# Altium schematic sheet P-MT3620RDB-PS-1-0.SchDoc: MT3620 Prototyping Shield
size A3; DrawnBy: Nick Trim; Revision: 1.0; SheetNumber: 1; SheetTotal: 1
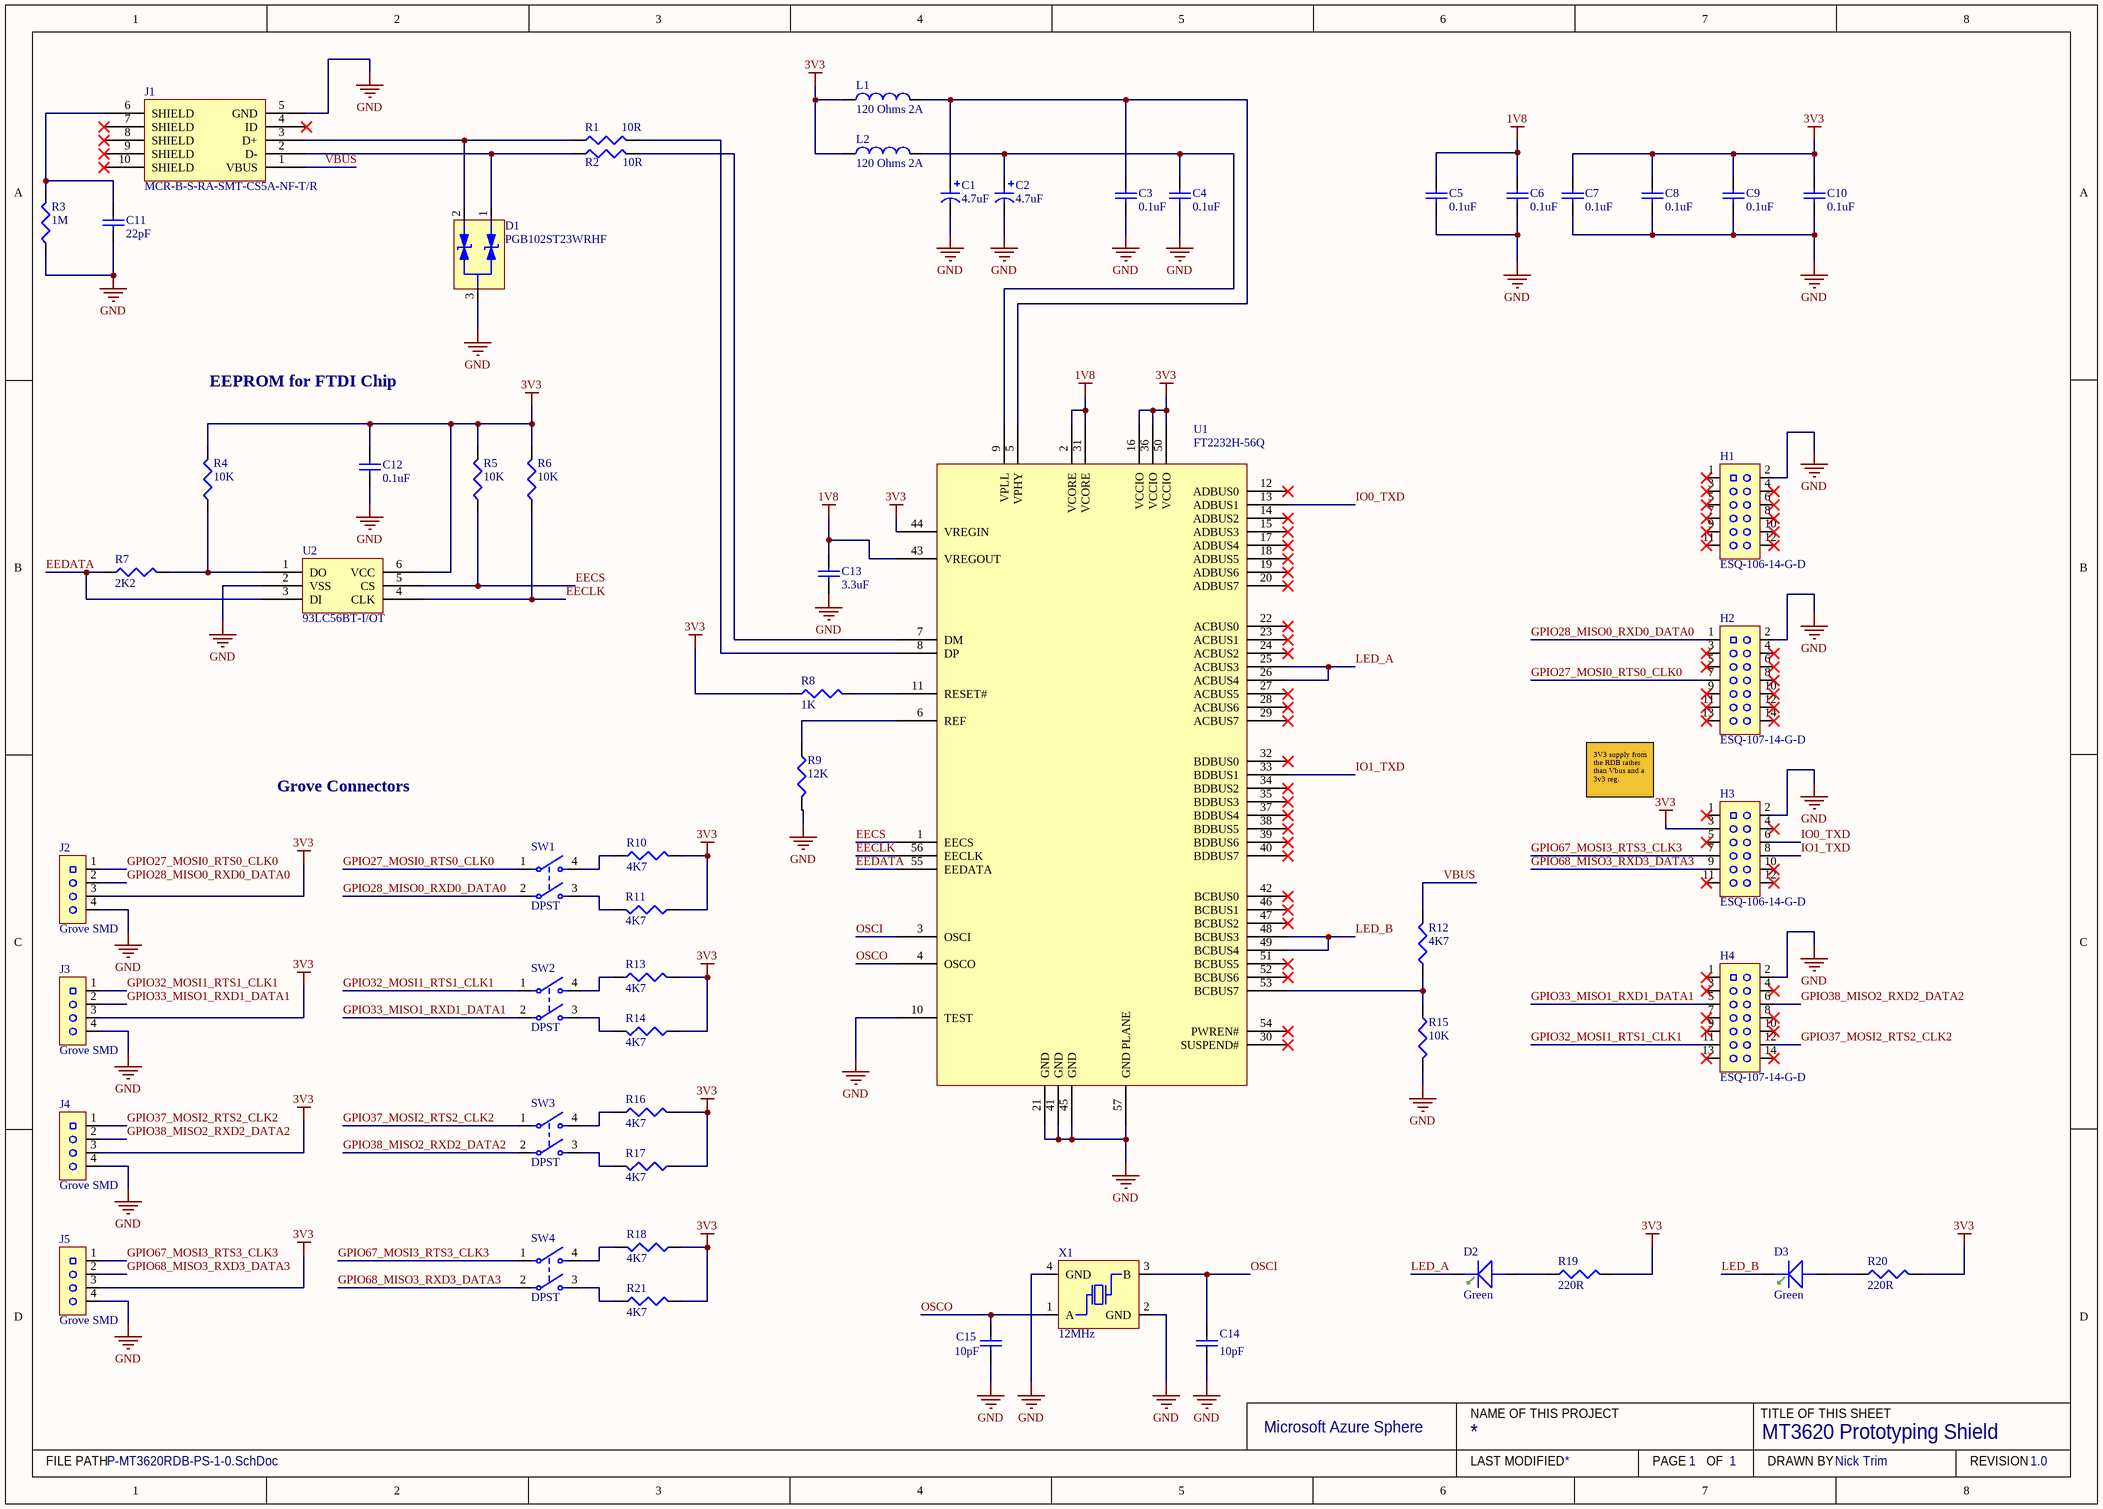
[diagram p0: P-MT3620RDB-PS-1-0.SchDoc]

## Parts
C1  4.7uF  [C0603_TANT]
C2  4.7uF  [C0603_TANT]
C3  0.1uF  [C0603]
C4  0.1uF  [C0603]
C5  0.1uF  [C0603]
C6  0.1uF  [C0603]
C7  0.1uF  [C0603]
C8  0.1uF  [C0603]
C9  0.1uF  [C0603]
C10  0.1uF  [C0603]
C11  22pF  [C0603]
C12  0.1uF  [C0603]
C13  3.3uF  [C0603]
C14  10pF  [C0603]
C15  10pF  [C0603]
D1  PGB102ST23WRHF  [SOT95P245X110-3N]
D2  Green  [Rohm SML-D12 Green]
D3  Green  [Rohm SML-D12 Green]
H1  ESQ-106-14-G-D  [ESQ-106]
H2  ESQ-107-14-G-D  [ESQ-107]
H3  ESQ-106-14-G-D  [ESQ-106]
H4  ESQ-107-14-G-D  [ESQ-107]
J1  MCR-B-S-RA-SMT-CS5A-NF-T/R  [MCR-B-S-RA-SMT-CS5-T/R]
J2  Grove SMD  [Grove way SMD]
J3  Grove SMD  [Grove way SMD]
J4  Grove SMD  [Grove way SMD]
J5  Grove SMD  [Grove way SMD]
L1  120 Ohms 2A  [0603 IND]
L2  120 Ohms 2A  [0603 IND]
R1  10R  [R0603]
R2  10R  [R0603]
R3  1M  [R0603]
R4  10K  [R0603]
R5  10K  [R0603]
R6  10K  [R0603]
R7  2K2  [R0603]
R8  1K  [R0603]
R9  12K  [R0603]
R10  4K7  [R0603]
R11  4K7  [R0603]
R12  4K7  [R0603]
R13  4K7  [R0603]
R14  4K7  [R0603]
R15  10K  [R0603]
R16  4K7  [R0603]
R17  4K7  [R0603]
R18  4K7  [R0603]
R19  220R  [R0603]
R20  220R  [R0603]
R21  4K7  [R0603]
SW1  DPST  [204-211ST]
SW2  DPST  [204-211ST]
SW3  DPST  [204-211ST]
SW4  DPST  [204-211ST]
U1  FT2232H-56Q  [FT2232H-56Q]
U2  93LC56BT-I/OT  [SOT23-93C56B]
X1  12MHz  [TXC8Z]

## Nets
1V8: C5.2 C6.2 C13.2 U1.2(VCORE) U1.31(VCORE) U1.43(VREGOUT)
3V3: C7.1 C8.2 C9.2 C10.2 C12.2 H3.3 J2.3 J3.3 J4.3 J5.3 L1.1 L2.1 R4.2 R5.2 R6.2 R8.1 R10.2 R11.1 R13.2 R14.1 R16.2 R17.1 R18.1 R19.2 R20.2 R21.2 U1.16(VCCIO) U1.36(VCCIO) U1.44(VREGIN) U1.50(VCCIO) U2.6(VCC)
GND: C1.2 C2.2 C3.2 C4.1 C5.1 C6.1 C7.2 C8.1 C9.1 C10.1 C11.1 C12.1 C13.1 C14.2 C15.2 D1.3 H1.2 H2.2 H3.2 H4.2 J1.5(GND) J2.4 J3.4 J4.4 J5.4 R3.1 R9.2 R15.2 U1.10(TEST) U1.21(GND) U1.41(GND) U1.45(GND) U1.57(GND_PLANE) U2.2(VSS) X1.2(GND) X1.4(GND)
EECLK: R6.1 U1.56(EECLK) U2.4(CLK)
EECS: R5.1 U1.1(EECS) U2.5(CS)
EEDATA: R7.1 U1.55(EEDATA) U2.3(DI)
GPIO27_MOSI0_RTS0_CLK0: H2.7 J2.1 SW1.1
GPIO28_MISO0_RXD0_DATA0: H2.1 J2.2 SW1.2
GPIO32_MOSI1_RTS1_CLK1: H4.11 J3.1 SW2.1
GPIO33_MISO1_RXD1_DATA1: H4.5 J3.2 SW2.2
GPIO37_MOSI2_RTS2_CLK2: H4.12 J4.1 SW3.1
GPIO38_MISO2_RXD2_DATA2: H4.6 J4.2 SW3.2
GPIO67_MOSI3_RTS3_CLK3: H3.7 J5.1 SW4.1
GPIO68_MISO3_RXD3_DATA3: H3.9 J5.2 SW4.2
IO0_TXD: H3.6 U1.13(ADBUS1)
IO1_TXD: H3.8 U1.33(BDBUS1)
LED_A: D2.1 U1.25(ACBUS3) U1.26(ACBUS4)
LED_B: D3.1 U1.48(BCBUS3) U1.49(BCBUS4)
OSCI: C14.1 U1.3(OSCI) X1.3(B)
OSCO: C15.1 U1.4(OSCO) X1.1(A)
VBUS: J1.1(VBUS) R12.2
NetC1_1: C1.1 C3.1 L1.2 U1.5(VPHY)
NetC2_1: C2.1 C4.2 L2.2 U1.9(VPLL)
NetC11_2: C11.2 J1.6(SHIELD) R3.2
NetD1_1: D1.1 J1.2(D-) R2.1
NetD1_2: D1.2 J1.3(D+) R1.1
NetD2_2: D2.2 R19.1
NetD3_2: D3.2 R20.1
NetR1_2: R1.2 U1.8(DP)
NetR2_2: R2.2 U1.7(DM)
NetR4_1: R4.1 R7.2 U2.1(DO)
NetR8_2: R8.2 U1.11(RESET#)
NetR9_1: R9.1 U1.6(REF)
NetR10_1: R10.1 SW1.4
NetR11_2: R11.2 SW1.3
NetR12_1: R12.1 R15.1 U1.53(BCBUS7)
NetR13_1: R13.1 SW2.4
NetR14_2: R14.2 SW2.3
NetR16_1: R16.1 SW3.4
NetR17_2: R17.2 SW3.3
NetR18_2: R18.2 SW4.4
NetR21_1: R21.1 SW4.3

Not connected (* = marked no-connect by the designer): H1 1* 3* 4* 5* 6* 7* 8* 9* 10* 11* 12*; H2 3* 4* 5* 6* 8* 9* 10* 11* 12* 13* 14*; H3 1* 4* 5* 10* 11* 12*; H4 1* 3* 4* 7* 8* 9* 10* 13* 14*; J1 4(ID)* 7(SHIELD)* 8(SHIELD)* 9(SHIELD)* 10(SHIELD)*; U1 12(ADBUS0)* 14(ADBUS2)* 15(ADBUS3)* 17(ADBUS4)* 18(ADBUS5)* 19(ADBUS6)* 20(ADBUS7)* 22(ACBUS0)* 23(ACBUS1)* 24(ACBUS2)* 27(ACBUS5)* 28(ACBUS6)* 29(ACBUS7)* 30(SUSPEND#)* 32(BDBUS0)* 34(BDBUS2)* 35(BDBUS3)* 37(BDBUS4)* 38(BDBUS5)* 39(BDBUS6)* 40(BDBUS7)* 42(BCBUS0)* 46(BCBUS1)* 47(BCBUS2)* 51(BCBUS5)* 52(BCBUS6)* 54(PWREN#)*

## Notes on the sheet
- EEPROM for FTDI Chip
- Grove Connectors
- 3V3 supply from the RDB rather than Vbus and a 3v3 reg.
- Microsoft Azure Sphere
- NAME OF THIS PROJECT
- TITLE OF THIS SHEET
- FILE PATH
- LAST MODIFIED
- PAGE
- OF
- DRAWN BY
- REVISION

## Library data of the parts
C1 C2 = F981A475MMA: AVX - F981A475MMA - Surface Mount Tantalum Capacitor, 4.7 µF, 10 V, 0603 [1608 Metric], F98 Series, ± 20%, -55 °C; Manufacturer: Kyocera AVX; Voltage Rating: 10V; ESR (Equivalent Series Resistance): 6R; Supplier 1: Digi-Key; Manufacturer Part Number: F981A475MMA; RoHS: Yes; Category: Tantalum Capacitors; Stock 1: 17846; Pricing 1: 1=0.59000, 10=0.41800, 50=0.31640, 100=0.27560, 500=0.20412, 1000=0.17350 (USD); Mount: Surface Mount; Case/Package: 0603; Case Code (Imperial): 0603; Case Code (Metric): 1608; Min Operating Temperature: -55°C; Max Operating Temperature: 125°C; Features: General Purpose; Packaging: Tape and Reel; Capacitance: 4.7uF; Tolerance: 20%; ComponentLink1URL: http://www.farnell.com/datasheets/2602422.pdf?src-supplier=Farnell; ComponentLink1Description: http://www.farnell.com/datasheets/2602422.pdf?src-supplier=Farnell; ComponentLink2URL: http://www.mouser.com/ds/2/40/f98-775787.pdf?src-supplier=Mouser; ComponentLink2Description: http://www.mouser.com/ds/2/40/f98-775787.pdf?src-supplier=Mouser; ComponentLink3URL: http://datasheets.avx.com/F98.pdf?src-supplier=Digi-Key; ComponentLink3Description: http://datasheets.avx.com/F98.pdf?src-supplier=Digi-Key; ComponentLink4URL: http://www.farnell.com/datasheets/2602422.pdf?src-supplier=Newark; ComponentLink4Description: http://www.farnell.com/datasheets/2602422.pdf?src-supplier=Newark; Supplier Part Number 1: 478-8651-1-ND
C3-C10 C12 = CL10B104KB8NNNL: CL10 Series 0603 0.1 uF 50 V ±10% Tolerance X7R Multilayer Ceramic Capacitor; Manufacturer: Samsung; Capacitance: 100nF; Voltage Rating: 50V; Supplier 1: Digi-Key; Manufacturer Part Number: CL10B104KB8NNNL; RoHS: Yes; Category: Ceramic Capacitors; Stock 1: 148896; Pricing 1: 1=0.10000, 10=0.02900, 50=0.01580, 100=0.01280, 500=0.00916, 1000=0.00720, 2500=0.00654, 5000=0.00602 (USD); Mount: Surface Mount; Case/Package: 0603; Min Operating Temperature: -55°C; Max Operating Temperature: 125°C; Tolerance: 10%; Packaging: Tape and Reel; Package Quantity: 15000; Dielectric: X7R; Voltage Rating (DC): 50V; Length: 1.6mm; Width: 0.031inch; Height: 0.8mm; Thickness: 0.035inch; Depth: 0.8mm; Radiation Hardening: No; ComponentLink1URL: https://datasheet.ciiva.com/26838/getdatasheetpartid-357523-26838415.pdf?src-supplier=Verical; ComponentLink1Description: https://datasheet.ciiva.com/26838/getdatasheetpartid-357523-26838415.pdf?src-supplier=Verical; ComponentLink2URL: https://datasheet.ciiva.com/25741/cl10b104kb8nnnl-25741341.pdf?src-supplier=Digi-Key; ComponentLink2Description: https://datasheet.ciiva.com/25741/cl10b104kb8nnnl-25741341.pdf?src-supplier=Digi-Key; Supplier Part Number 1: 1276-CL10B104KB8NNNLCT-ND
C11 = CC0603JRNPO9BN220: Cap Ceramic 22pF 50VDC C0G 5% SMD 0603 Paper T/R; Manufacturer: Yageo; Voltage Rating: 50V; Temperature Coefficient: 30ppm/°C; Insulation Resistance: 10GR; Supplier 1: Digi-Key; Manufacturer Part Number: CC0603JRNPO9BN220; RoHS: Yes; Category: Ceramic Capacitors; Stock 1: 139430; Pricing 1: 1=0.10000, 10=0.04200, 50=0.02320, 100=0.01890, 500=0.01348, 1000=0.01059 (USD); Mount: Surface Mount; Case/Package: 0603; Number of Pins: 2; Case Code (Imperial): 0603; Case Code (Metric): 1608; Min Operating Temperature: -55°C; Max Operating Temperature: 125°C; Capacitance: 22pF; Tolerance: 5%; Voltage Rating (DC): 50V; Packaging: Tape and Reel; Package Quantity: 1; Dielectric: C0G; Termination: SMD/SMT; Voltage: 50V; Length: 1.6mm; Width: 0.031inch; Height: 0.8mm; Thickness: 0.035inch; Depth: 0.8mm; Radiation Hardening: No; REACH SVHC: No SVHC; Lead Free: Lead Free; ComponentLink1URL: https://datasheet.ciiva.com/11786/0900766b8079c870-11786216.pdf?src-supplier=RSComponents; ComponentLink1Description: https://datasheet.ciiva.com/11786/0900766b8079c870-11786216.pdf?src-supplier=RSComponents; ComponentLink2URL: https://datasheet.ciiva.com/8033/1734582-8033749.pdf?src-supplier=Element14; ComponentLink2Description: https://datasheet.ciiva.com/8033/1734582-8033749.pdf?src-supplier=Element14; ComponentLink3URL: https://datasheet.ciiva.com/144/mlccorderingcode-144631.pdf?src-supplier=Digi-Key; ComponentLink3Description: https://datasheet.ciiva.com/144/mlccorderingcode-144631.pdf?src-supplier=Digi-Key; ComponentLink4URL: https://datasheet.ciiva.com/28450/1443161-28450487.pdf?src-supplier=Element14; ComponentLink4Description: https://datasheet.ciiva.com/28450/1443161-28450487.pdf?src-supplier=Element14; ComponentLink5URL: https://datasheet.ciiva.com/144/mlccorderingcode-144632.pdf?src-supplier=Digi-Key; ComponentLink5Description: https://datasheet.ciiva.com/144/mlccorderingcode-144632.pdf?src-supplier=Digi-Key; ComponentLink6URL: https://datasheet.ciiva.com/11464/upy-gp-np0-16v-to-50v-8-11464728.pdf?src-supplier=Avnet; ComponentLink6Description: https://datasheet.ciiva.com/11464/upy-gp-np0-16v-to-50v-8-11464728.pdf?src-supplier=Avnet; ComponentLink7URL: https://datasheet.ciiva.com/144/mlccorderingcode-144633.pdf?src-supplier=Digi-Key; ComponentLink7Description: https://datasheet.ciiva.com/144/mlccorderingcode-144633.pdf?src-supplier=Digi-Key; ComponentLink8URL: https://datasheet.ciiva.com/46430/1835847-46430153.pdf?src-supplier=Element14; ComponentLink8Description: https://datasheet.ciiva.com/46430/1835847-46430153.pdf?src-supplier=Element14; ComponentLink9URL: https://datasheet.ciiva.com/16625/upy-gp-np0-16v-to-50v-8-16625518.pdf?src-supplier=Avnet+Europe; ComponentLink9Description: https://datasheet.ciiva.com/16625/upy-gp-np0-16v-to-50v-8-16625518.pdf?src-supplier=Avnet+Europe; Supplier Part Number 1: 311-1062-1-ND
C13 = CL10A335KP8NNNC: CAP CER 3.3UF 10V X5R 0603; Manufacturer: Samsung; Tolerance: 10%; Supplier 1: Digi-Key; Manufacturer Part Number: CL10A335KP8NNNC; RoHS: Yes; Category: Ceramic Capacitors; Stock 1: 195650; Pricing 1: 1=0.20000, 10=0.13600, 50=0.08180, 100=0.06910, 500=0.04730, 1000=0.04185 (USD); Mount: Surface Mount; Case/Package: 0603; Case Code (Metric): 1608; Case Code (Imperial): 0603; Min Operating Temperature: -55°C; Max Operating Temperature: 85°C; Packaging: Tape and Reel; Capacitance: 3.3uF; Package Quantity: 1; Voltage Rating: 10V; Voltage Rating (DC): 10V; Dielectric: X5R; Length: 1.6mm; Width: 0.031inch; Height: 0.8mm; Thickness: 0.035inch; Depth: 0.8mm; Radiation Hardening: No; Lead Free: Lead Free; ComponentLink1URL: https://datasheet.ciiva.com/25794/cl10a335kp8nnnc-25794982.pdf?src-supplier=Digi-Key; ComponentLink1Description: https://datasheet.ciiva.com/25794/cl10a335kp8nnnc-25794982.pdf?src-supplier=Digi-Key; ComponentLink2URL: https://datasheet.ciiva.com/26838/getdatasheetpartid-362799-26838374.pdf?src-supplier=Verical; ComponentLink2Description: https://datasheet.ciiva.com/26838/getdatasheetpartid-362799-26838374.pdf?src-supplier=Verical; Supplier Part Number 1: 1276-1892-1-ND
C14 C15 = CC0603FRNPO0BN100: Cap Cer 10PF 100V Npo 0603; Manufacturer: Yageo; Tolerance: 1%; Supplier 1: Digi-Key; Manufacturer Part Number: CC0603FRNPO0BN100; RoHS: Yes; Category: Ceramic Capacitors; Stock 1: 23309; Pricing 1: 1=0.19000, 10=0.12700, 50=0.07620, 100=0.06440, 500=0.04408, 1000=0.03899 (USD); Mount: Surface Mount; Case/Package: 0603; Min Operating Temperature: -55°C; Max Operating Temperature: 125°C; Packaging: Tape and Reel; Capacitance: 10pF; Voltage Rating: 100V; Length: 0.063inch; Width: 0.031inch; Thickness: 0.035inch; ComponentLink1URL: https://media.digikey.com/pdf/Data%20Sheets/Yageo%20PDFs/CCseries_mlcc_2002.pdf?src-supplier=Digi-Key; ComponentLink1Description: https://media.digikey.com/pdf/Data%20Sheets/Yageo%20PDFs/CCseries_mlcc_2002.pdf?src-supplier=Digi-Key; ComponentLink2URL: http://www.yageo.com/exep/pages/download/literatures/ProductSelectionGuide%202014_Final_2.pdf?src-supplier=Digi-Key; ComponentLink2Description: http://www.yageo.com/exep/pages/download/literatures/ProductSelectionGuide%202014_Final_2.pdf?src-supplier=Digi-Key; Supplier Part Number 1: 311-3876-1-ND
D1 = PGB102ST23WRHF: Tvs Diode 24V 150V SOT23-3; Manufacturer: Littelfuse; Direction: Bidirectional; Capacitance: 0.12pF; Number of Bidirectional Channels: 2; Power Line Protection: No; Leakage Current: 1nA; Element Configuration: Dual; Diode Type: ZENER; Supplier 1: Digi-Key; Manufacturer Part Number: PGB102ST23WRHF; RoHS: Yes; Category: TVS Diodes; Stock 1: 1690; Pricing 1: 1=0.95000, 10=0.85300, 100=0.66510, 500=0.54946, 1000=0.43904 (USD); Mount: Surface Mount; Case/Package: SOT-23; Number of Pins: 3; Min Operating Temperature: -65°C; Max Operating Temperature: 125°C; Package Quantity: 1; Packaging: Tape and Reel; Reverse Standoff Voltage: 24V; Clamping Voltage: 150V; Number of Channels: 2; Termination: SMD/SMT; Working Voltage: 24V; Resistor Type: Zener; Series: PulseGuard® PGB; Length: 3mm; Height: 0.69mm; Depth: 2.24mm; Radiation Hardening: No; RoHS Compliant: Yes; ComponentLink1URL: https://datasheet.ciiva.com/25606/0900766b81107f7b-25606505.pdf?src-supplier=RSComponents; ComponentLink1Description: https://datasheet.ciiva.com/25606/0900766b81107f7b-25606505.pdf?src-supplier=RSComponents; ComponentLink2URL: https://datasheet.ciiva.com/341/littelfuse-pulseguard-esd-pgb1-341254.pdf?src-supplier=Digi-Key; ComponentLink2Description: https://datasheet.ciiva.com/341/littelfuse-pulseguard-esd-pgb1-341254.pdf?src-supplier=Digi-Key; ComponentLink3URL: https://datasheet.ciiva.com/349/littelfuse-pulseguard-esd-pgb1-349471.pdf?src-supplier=Digi-Key; ComponentLink3Description: https://datasheet.ciiva.com/349/littelfuse-pulseguard-esd-pgb1-349471.pdf?src-supplier=Digi-Key; ComponentLink4URL: https://datasheet.ciiva.com/354/littelfuse-pulseguard-esd-pgb1-354671.pdf?src-supplier=Digi-Key; ComponentLink4Description: https://datasheet.ciiva.com/354/littelfuse-pulseguard-esd-pgb1-354671.pdf?src-supplier=Digi-Key; Supplier Part Number 1: F3800CT-ND
D2 D3 = SML-D12P8WT86: ROHM - SML-D12P8WT86 - LED, EXCELED, Green, SMD, 0603, 20 mA, 2.2 V, 560 nm; Lens Color: White; Lens Style: Rectangular,Diffused,Colorless; Forward Voltage: 2.2V; Viewing Angle: 160°; Forward Current: 20mA; Luminous Intensity: 6.3mcd; Dominant Wavelength: 560nm; Lens Transparency: Diffused; Number of LEDs: 1; Supplier 1: Digi-Key; Manufacturer: Rohm; Manufacturer Part Number: SML-D12P8WT86; RoHS: Yes; Category: LEDs; Stock 1: 30006; Pricing 1: 1=0.31000, 10=0.22600, 100=0.10730, 500=0.07200, 1000=0.05640 (USD); Mount: Surface Mount; Case/Package: 0603; Number of Pins: 2; Color: Green; Case Code (Metric): 1608; Case Code (Imperial): 0603; Min Operating Temperature: -40°C; Max Operating Temperature: 85°C; Package Quantity: 1; Packaging: Tape and Reel; Illumination Color: Green; Test Current: 20mA; Wavelength: 560nm; Length: 1.6mm; Width: 0.8mm; Height: 0.65mm; Radiation Hardening: No; REACH SVHC: Unknown; Lead Free: Lead Free; ComponentLink1URL: https://datasheet.ciiva.com/2110/sml-d1-2110417.pdf?src-supplier=Digi-Key; ComponentLink1Description: https://datasheet.ciiva.com/2110/sml-d1-2110417.pdf?src-supplier=Digi-Key; ComponentLink2URL: https://datasheet.ciiva.com/16488/rohm20sml-d12p8wt86-16488100.pdf?src-supplier=Future+Electronics; ComponentLink2Description: https://datasheet.ciiva.com/16488/rohm20sml-d12p8wt86-16488100.pdf?src-supplier=Future+Electronics; ComponentLink3URL: https://datasheet.ciiva.com/2110/sml-d1-2110418.pdf?src-supplier=Digi-Key; ComponentLink3Description: https://datasheet.ciiva.com/2110/sml-d1-2110418.pdf?src-supplier=Digi-Key; ComponentLink4URL: https://datasheet.ciiva.com/2110/sml-d1-2110419.pdf?src-supplier=Digi-Key; ComponentLink4Description: https://datasheet.ciiva.com/2110/sml-d1-2110419.pdf?src-supplier=Digi-Key; ComponentLink5URL: https://datasheet.ciiva.com/3161/sml-d1-3161420.pdf?src-supplier=Avnet; ComponentLink5Description: https://datasheet.ciiva.com/3161/sml-d1-3161420.pdf?src-supplier=Avnet; Supplier Part Number 1: 511-1579-1-ND
H1 H3 = ESQ-106-14-G-D: Conn Elevated Socket SKT 12 POS 2.54mm Solder ST Thru-Hole Tube; Manufacturer: Samtec; Number of Contacts: 12; Gender: Receptacle; Max Voltage Rating (AC): 550V; Max Current Rating: 6.9A; Contact Resistance: 10mR; Supplier 1: Digi-Key; Manufacturer Part Number: ESQ-106-14-G-D; RoHS: Yes; Category: Connectors; Stock 1: 143; Pricing 1: 1=3.20000, 10=3.07200, 100=2.56000, 500=2.17600, 1000=1.85600, 5000=1.66400 (USD); Housing Color: Black; Housing Material: Polyester; Contact Plating: Gold; Contact Material: Bronze; Min Operating Temperature: -55°C; Max Operating Temperature: 125°C; Termination: Solder; Orientation: Straight; Packaging: Bulk; Number of Rows: 2; Length: 15.75mm; Pitch: 2.54mm; Depth: 4.95mm; Radiation Hardening: No; REACH SVHC: No SVHC; ComponentLink1URL: http://www.farnell.com/datasheets/1992053.pdf?src-supplier=Farnell; ComponentLink1Description: http://www.farnell.com/datasheets/1992053.pdf?src-supplier=Farnell; ComponentLink2URL: http://components.arrow.com/part/dataview/0323_01321805?src-supplier=Arrow+Europe; ComponentLink2Description: http://components.arrow.com/part/dataview/0323_01321805?src-supplier=Arrow+Europe; ComponentLink3URL: http://www.samtec.com/documents/webfiles/pdf/ESW_TH.PDF?src-supplier=Avnet+Europe; ComponentLink3Description: http://www.samtec.com/documents/webfiles/pdf/ESW_TH.PDF?src-supplier=Avnet+Europe; ComponentLink4URL: http://www.samtec.com/documents/webfiles/pdf/ESW_TH.PDF?src-supplier=Avnet; ComponentLink4Description: http://www.samtec.com/documents/webfiles/pdf/ESW_TH.PDF?src-supplier=Avnet; ComponentLink5URL: http://suddendocs.samtec.com/prints/esq-1xx-xx-x-x-xxx-xx-x-xx-mkt.pdf?src-supplier=Digi-Key; ComponentLink5Description: http://suddendocs.samtec.com/prints/esq-1xx-xx-x-x-xxx-xx-x-xx-mkt.pdf?src-supplier=Digi-Key; Supplier Part Number 1: SAM15564-ND
H2 H4 = ESQ-107-14-G-D: SAMTEC         ESQ-107-14-G-D             Board-To-Board Connector, Elevated, ESQ Series, 14 Contacts, Receptacle, 2.54 mm, Solder, 2 Rows; Max Current Rating: 6.9A; Contact Resistance: 10mR; Max Voltage Rating (AC): 550V; Number of Contacts: 14; Pitch: 2.54mm; Supplier 1: Digi-Key; Manufacturer: Samtec; Manufacturer Part Number: ESQ-107-14-G-D; RoHS: Yes; Category: Headers and Wire Housings; Stock 1: 55; Pricing 1: 1=3.73000, 10=3.57600, 100=2.98000, 500=2.53300, 1000=2.16050, 5000=1.93700 (USD); Contact Plating: Gold; Contact Material: Bronze; Housing Material: Polyester; Housing Color: Black; Min Operating Temperature: -55°C; Max Operating Temperature: 125°C; Number of Rows: 2; Packaging: Rail/Tube; Orientation: Straight; Termination: Solder; Gender: Receptacle; Length: 18.29mm; Depth: 4.95mm; Radiation Hardening: No; REACH SVHC: No SVHC; Lead Free: Lead Free; ComponentLink1URL: http://components.arrow.com/part/dataview/0323_01327688?src-supplier=Arrow+Europe; ComponentLink1Description: http://components.arrow.com/part/dataview/0323_01327688?src-supplier=Arrow+Europe; ComponentLink2URL: http://www.farnell.com/datasheets/1992053.pdf?src-supplier=Farnell; ComponentLink2Description: http://www.farnell.com/datasheets/1992053.pdf?src-supplier=Farnell; ComponentLink3URL: http://cloud.samtec.com/catalog_english/ESW_TH.PDF?src-supplier=Avnet; ComponentLink3Description: http://cloud.samtec.com/catalog_english/ESW_TH.PDF?src-supplier=Avnet; ComponentLink4URL: http://suddendocs.samtec.com/prints/esq-1xx-xx-x-x-xxx-xx-x-xx-mkt.pdf?src-supplier=Digi-Key; ComponentLink4Description: http://suddendocs.samtec.com/prints/esq-1xx-xx-x-x-xxx-xx-x-xx-mkt.pdf?src-supplier=Digi-Key; Supplier Part Number 1: SAM15567-ND
J1 = MCR-B-S-RA-SMT-CS5A-NF-T/R: Manufacturer: Adam Equipment; Supplier 1: Digi-Key; Manufacturer Part Number: MCR-B-S-RA-SMT-CS5A-NF-T/R; RoHS: No; Stock 1: 718; Pricing 1: 1=0.34000, 10=0.31800, 25=0.27280, 50=0.23180, 100=0.22270, 250=0.20000, 500=0.19090 (USD); Supplier Part Number 1: 2057-MCR-B-S-RA-SMT-CS5A-NF-T/RCT-ND
J2-J5 = 114020163: Manufacturer: Seeed Studio; Supplier 1: Digi-Key; Manufacturer Part Number: 114020163; RoHS: No; Stock 1: 848; Pricing 1: 1=2.96000 (USD); Supplier Part Number 1: 1597-114020163-ND
L1 L2 = BLM18PG121SN1D: MURATA - BLM18PG121SN1D - FERRITE, BEAD, 0603, 0.05OHM, 2A; Material: Steel,Ferrite; Tolerance: 25%; Impedance: 120R; Number of Lines: 1; DC Resistance (DCR): 50mR; Test Frequency: 100MHz; Shielding: Unshielded; Supplier 1: Digi-Key; Manufacturer: Murata; Manufacturer Part Number: BLM18PG121SN1D; RoHS: Yes; Category: Inductors; Stock 1: 386931; Pricing 1: 1=0.10000, 10=0.07600, 25=0.06920, 50=0.06220, 100=0.04550, 250=0.03312, 500=0.03036, 1000=0.02622 (USD); Case/Package: 0603; Number of Pins: 2; Core Material: Ferrite; Case Code (Metric): 1608; Case Code (Imperial): 0603; Min Operating Temperature: -55°C; Max Operating Temperature: 125°C; Package Quantity: 1; Max Current Rating: 2A; Packaging: Tape and Reel; Current Rating: 2A; Max DC Current: 2A; Termination: SMD/SMT; DC Current: 2A; Frequency: 100MHz; Number of Circuits: 1; Length: 1.6mm; Width: 0.8mm; Height: 0.8mm; Depth: 0.8mm; Radiation Hardening: No; REACH SVHC: No SVHC; Lead Free: Lead Free; ComponentLink1URL: https://datasheet.ciiva.com/5709/1740433-5709171.pdf?src-supplier=Farnell; ComponentLink1Description: https://datasheet.ciiva.com/5709/1740433-5709171.pdf?src-supplier=Farnell; ComponentLink2URL: https://datasheet.ciiva.com/11799/0900766b81275ca5-11799546.pdf?src-supplier=RSComponents; ComponentLink2Description: https://datasheet.ciiva.com/11799/0900766b81275ca5-11799546.pdf?src-supplier=RSComponents; ComponentLink3URL: https://datasheet.ciiva.com/19454/1845013-19454715.pdf?src-supplier=Jameco; ComponentLink3Description: https://datasheet.ciiva.com/19454/1845013-19454715.pdf?src-supplier=Jameco; ComponentLink4URL: https://datasheet.ciiva.com/29347/442365-da-01-en-chip-drossel-0603-120r-2000ma-1-6x0-8mm-29347911.pdf?src-supplier=Conrad; ComponentLink4Description: https://datasheet.ciiva.com/29347/442365-da-01-en-chip-drossel-0603-120r-2000ma-1-6x0-8mm-29347911.pdf?src-supplier=Conrad; ComponentLink5URL: https://datasheet.ciiva.com/3081/l0110s0100blm18p-3081632.pdf?src-supplier=Avnet; ComponentLink5Description: https://datasheet.ciiva.com/3081/l0110s0100blm18p-3081632.pdf?src-supplier=Avnet; ComponentLink6URL: https://datasheet.ciiva.com/8021/1740433-8021493.pdf?src-supplier=Element14; ComponentLink6Description: https://datasheet.ciiva.com/8021/1740433-8021493.pdf?src-supplier=Element14; ComponentLink7URL: https://datasheet.ciiva.com/6212/l0110s0100blm18p-6212502.pdf?src-supplier=Digi-Key; ComponentLink7Description: https://datasheet.ciiva.com/6212/l0110s0100blm18p-6212502.pdf?src-supplier=Digi-Key; ComponentLink8URL: https://datasheet.ciiva.com/8021/1740433-8021494.pdf?src-supplier=Element14; ComponentLink8Description: https://datasheet.ciiva.com/8021/1740433-8021494.pdf?src-supplier=Element14; ComponentLink9URL: https://datasheet.ciiva.com/6212/l0110s0100blm18p-6212504.pdf?src-supplier=Digi-Key; ComponentLink9Description: https://datasheet.ciiva.com/6212/l0110s0100blm18p-6212504.pdf?src-supplier=Digi-Key; ComponentLink10URL: https://datasheet.ciiva.com/14122/blm-series-eng-tds-14122905.pdf?src-supplier=Distrelec; ComponentLink10Description: https://datasheet.ciiva.com/14122/blm-series-eng-tds-14122905.pdf?src-supplier=Distrelec; ComponentLink11URL: https://datasheet.ciiva.com/25903/l0110s0100blm18p-25903483.pdf?src-supplier=Avnet+Europe; ComponentLink11Description: https://datasheet.ciiva.com/25903/l0110s0100blm18p-25903483.pdf?src-supplier=Avnet+Europe; ComponentLink12URL: https://datasheet.ciiva.com/41449/001172297-da-01-en-drossel-0603-120r-1-6x0-8mm-4000st-41449659.pdf?src-supplier=Conrad; ComponentLink12Description: https://datasheet.ciiva.com/41449/001172297-da-01-en-drossel-0603-120r-1-6x0-8mm-4000st-41449659.pdf?src-supplier=Conrad; Supplier Part Number 1: 490-1037-1-ND
R1 R2 = RC0603FR-0710RL: YAGEO (PHYCOMP) - RC0603FR-0710RL - RES, THICK FILM, 10R, 1%, 0.1W, 0603; Voltage Rating (DC): 50V; Temperature Coefficient: 200ppm/°C; Power Rating: 100mW; Supplier 1: Digi-Key; Manufacturer: Yageo; Manufacturer Part Number: RC0603FR-0710RL; RoHS: Yes; Category: Chip SMD Resistors; Stock 1: 5266978; Pricing 1: 1=0.10000, 10=0.04800, 100=0.01940, 1000=0.00872, 2500=0.00756 (USD); Case/Package: 0603; Number of Pins: 2; Case Code (Imperial): 0603; Case Code (Metric): 1608; Size Code: 0603; Contact Plating: Tin,Matte; Min Operating Temperature: -55°C; Max Operating Temperature: 155°C; Packaging: Tape and Reel; Resistance: 10R; Tolerance: 1%; Resistor Type: Thick Film; Voltage Rating: 50V; Termination: SMD/SMT; Features: Moisture Resistant; Series: RC; Max Power Dissipation: 100mW; Number of Terminations: 2; Resistance Tolerance: 1%; Technology: THICK FILM; Construction: Rectangular; Length: 1.6mm; Width: 0.8mm; Height: 0.45mm; Depth: 0.8mm; Radiation Hardening: No; REACH SVHC: No SVHC; Lead Free: Lead Free; RoHS Compliant: Yes; Military Standard: Not; Supplier Part Number 1: 311-10.0HRCT-ND
R3 = AC0603FR-071ML: RES SMD 1M OHM 1% 1/10W 0603; Manufacturer: Yageo; Resistance: 1MR; Power Rating: 100mW; Voltage Rating: 50V; Temperature Coefficient: 100ppm/°C; Supplier 1: Digi-Key; Manufacturer Part Number: AC0603FR-071ML; RoHS: Yes; Category: Chip SMD Resistors; Stock 1: 36423; Pricing 1: 1=0.10000, 10=0.02500, 100=0.01030, 1000=0.00464, 2500=0.00402 (USD); Case/Package: 0603; Case Code (Metric): 1608; Case Code (Imperial): 0603; Min Operating Temperature: -55°C; Max Operating Temperature: 155°C; Package Quantity: 1; Tolerance: 1%; Packaging: Tape and Reel; Resistor Type: Thick Film; Number of Terminations: 2; Termination: SMD/SMT; Max Power Dissipation: 100mW; Features: Moisture Resistant,Automotive AEC-Q200,Anti-Sulfur; Length: 0.063inch; Width: 0.031inch; Height: 0.022inch; Lead Free: Lead Free; ComponentLink1URL: https://datasheet.ciiva.com/5562/pyu-ac-51-rohs-l-2-5562551.pdf?src-supplier=Mouser; ComponentLink1Description: https://datasheet.ciiva.com/5562/pyu-ac-51-rohs-l-2-5562551.pdf?src-supplier=Mouser; Supplier Part Number 1: 311-1MLDCT-ND
R4-R6 R15 = RC0603FR-0710KL: Res General Purpose Thick Film 0603 10K Ohm 1% 1/10W ±100ppm/°C Molded SMD Paper T/R; Manufacturer: Yageo; Resistance: 10kR; Voltage Rating (DC): 50V; Power Rating: 100mW; Voltage Rating: 75V; Supplier 1: Digi-Key; Manufacturer Part Number: RC0603FR-0710KL; RoHS: Yes; Category: Chip SMD Resistors; Stock 1: 35778149; Pricing 1: 1=0.10000, 10=0.02100, 100=0.00850, 1000=0.00382, 2500=0.00331 (USD); Case/Package: 0603; Number of Pins: 2; Case Code (Imperial): 0603; Case Code (Metric): 1608; Weight: 7.1E-05oz; Min Operating Temperature: -55°C; Max Operating Temperature: 155°C; Packaging: Tape and Reel; Tolerance: 1%; Resistor Type: Thick Film; Temperature Coefficient: 100ppm/°C; Termination: SMD/SMT; Length: 1.6mm; Width: 0.8mm; Height: 0.45mm; Depth: 0.8mm; Lead Pitch: 0.3mm; REACH SVHC: No SVHC; Lead Free: Lead Free; Military Standard: Not; ComponentLink1URL: https://datasheet.ciiva.com/7660/38590-7660789.pdf?src-supplier=Element14; ComponentLink1Description: https://datasheet.ciiva.com/7660/38590-7660789.pdf?src-supplier=Element14; ComponentLink2URL: https://datasheet.ciiva.com/15189/getdatasheetpartid-409289-15189591.pdf?src-supplier=Verical; ComponentLink2Description: https://datasheet.ciiva.com/15189/getdatasheetpartid-409289-15189591.pdf?src-supplier=Verical; ComponentLink3URL: https://datasheet.ciiva.com/46440/1868787-46440891.pdf?src-supplier=Element14; ComponentLink3Description: https://datasheet.ciiva.com/46440/1868787-46440891.pdf?src-supplier=Element14; ComponentLink4URL: https://datasheet.ciiva.com/7983/443971-7983596.pdf?src-supplier=Element14; ComponentLink4Description: https://datasheet.ciiva.com/7983/443971-7983596.pdf?src-supplier=Element14; ComponentLink5URL: https://datasheet.ciiva.com/7746/1738695-7746239.pdf?src-supplier=Element14; ComponentLink5Description: https://datasheet.ciiva.com/7746/1738695-7746239.pdf?src-supplier=Element14; ComponentLink6URL: https://datasheet.ciiva.com/22747/443971-22747519.pdf?src-supplier=Element14; ComponentLink6Description: https://datasheet.ciiva.com/22747/443971-22747519.pdf?src-supplier=Element14; Supplier Part Number 1: 311-10.0KHRCT-ND
R7 = RC0603FR-072K2L: YAGEO - RC0603FR-072K2L.. - RES, THICK FILM, 2K2, 1%, 0.1W, 0603; Resistance: 2.2kR; Power Rating: 100mW; Temperature Coefficient: 100ppm/°C; Voltage Rating: 50V; Supplier 1: Digi-Key; Manufacturer: Yageo; Manufacturer Part Number: RC0603FR-072K2L; RoHS: Yes; Category: Chip SMD Resistors; Stock 1: 5536514; Pricing 1: 1=0.100000, 10=0.021000, 100=0.008500, 1000=0.003820, 2500=0.003310 (USD); Case/Package: 0603; Case Code (Imperial): 0603; Case Code (Metric): 1608; Min Operating Temperature: -55°C; Max Operating Temperature: 155°C; Tolerance: 1%; Packaging: Tape and Reel; Package Quantity: 1; Termination: SMD/SMT; Resistor Type: Thick Film; Number of Terminations: 2; Max Power Dissipation: 100mW; Features: Moisture Resistant; Length: 1.6mm; Width: 0.031inch; Height: 0.022inch; Depth: 0.8mm; REACH SVHC: No SVHC; Lead Free: Lead Free; Military Standard: Not; ComponentLink1URL: https://datasheet.ciiva.com/46440/1868787-46440902.pdf?src-supplier=Element14; ComponentLink1Description: https://datasheet.ciiva.com/46440/1868787-46440902.pdf?src-supplier=Element14; ComponentLink2URL: https://datasheet.ciiva.com/2453/pyu-r-int-thick-7-2453943.pdf?src-supplier=Digi-Key; ComponentLink2Description: https://datasheet.ciiva.com/2453/pyu-r-int-thick-7-2453943.pdf?src-supplier=Digi-Key; ComponentLink3URL: https://datasheet.ciiva.com/7660/1868787-7660791.pdf?src-supplier=Element14; ComponentLink3Description: https://datasheet.ciiva.com/7660/1868787-7660791.pdf?src-supplier=Element14; ComponentLink4URL: https://datasheet.ciiva.com/2453/pyu-r-int-thick-7-2453944.pdf?src-supplier=Digi-Key; ComponentLink4Description: https://datasheet.ciiva.com/2453/pyu-r-int-thick-7-2453944.pdf?src-supplier=Digi-Key; ComponentLink5URL: https://datasheet.ciiva.com/2453/pyu-r-int-thick-7-2453945.pdf?src-supplier=Digi-Key; ComponentLink5Description: https://datasheet.ciiva.com/2453/pyu-r-int-thick-7-2453945.pdf?src-supplier=Digi-Key; ComponentLink6URL: https://datasheet.ciiva.com/7746/1738695-7746315.pdf?src-supplier=Element14; ComponentLink6Description: https://datasheet.ciiva.com/7746/1738695-7746315.pdf?src-supplier=Element14; ComponentLink7URL: https://datasheet.ciiva.com/7746/1738695-7746316.pdf?src-supplier=Element14; ComponentLink7Description: https://datasheet.ciiva.com/7746/1738695-7746316.pdf?src-supplier=Element14; ComponentLink8URL: https://datasheet.ciiva.com/46394/443971-46394958.pdf?src-supplier=Element14; ComponentLink8Description: https://datasheet.ciiva.com/46394/443971-46394958.pdf?src-supplier=Element14; Supplier Part Number 1: 311-2.20KHRCT-ND
R8 = RC0603FR-071KL: RES SMD 1K OHM 1% 1/10W 0603; Manufacturer: Yageo; Resistance: 1kR; Temperature Coefficient: 100ppm/°C; Power Rating: 100mW; Voltage Rating: 50V; Supplier 1: Digi-Key; Manufacturer Part Number: RC0603FR-071KL; RoHS: Yes; Category: Chip SMD Resistors; Stock 1: 12968206; Pricing 1: 1=0.10000, 10=0.02100, 100=0.00850, 1000=0.00382, 2500=0.00331 (USD); Case/Package: 0603; Contact Plating: Tin,Matte; Case Code (Imperial): 0603; Case Code (Metric): 1608; Min Operating Temperature: -55°C; Max Operating Temperature: 155°C; Tolerance: 1%; Packaging: Tape and Reel; Resistor Type: Thick Film; Termination: SMD/SMT; Length: 1.6mm; Height: 0.45mm; Depth: 0.8mm; Radiation Hardening: No; REACH SVHC: No SVHC; Lead Free: Lead Free; Military Standard: Not; ComponentLink1URL: https://datasheet.ciiva.com/11808/0900766b80f96399-11808081.pdf?src-supplier=RSComponents; ComponentLink1Description: https://datasheet.ciiva.com/11808/0900766b80f96399-11808081.pdf?src-supplier=RSComponents; ComponentLink2URL: https://datasheet.ciiva.com/25906/pyu-rc0603-51-rohs-l-4-25906933.pdf?src-supplier=Avnet+Europe; ComponentLink2Description: https://datasheet.ciiva.com/25906/pyu-rc0603-51-rohs-l-4-25906933.pdf?src-supplier=Avnet+Europe; ComponentLink3URL: https://datasheet.ciiva.com/7660/1868787-7660790.pdf?src-supplier=Element14; ComponentLink3Description: https://datasheet.ciiva.com/7660/1868787-7660790.pdf?src-supplier=Element14; ComponentLink4URL: https://datasheet.ciiva.com/7746/1738695-7746279.pdf?src-supplier=Element14; ComponentLink4Description: https://datasheet.ciiva.com/7746/1738695-7746279.pdf?src-supplier=Element14; ComponentLink5URL: https://datasheet.ciiva.com/7746/1686128-7746280.pdf?src-supplier=Element14; ComponentLink5Description: https://datasheet.ciiva.com/7746/1686128-7746280.pdf?src-supplier=Element14; ComponentLink6URL: https://datasheet.ciiva.com/28386/pyu-rc0603-51-rohs-l-4-28386648.pdf?src-supplier=Avnet+Europe; ComponentLink6Description: https://datasheet.ciiva.com/28386/pyu-rc0603-51-rohs-l-4-28386648.pdf?src-supplier=Avnet+Europe; ComponentLink7URL: https://datasheet.ciiva.com/7746/1738695-7746281.pdf?src-supplier=Element14; ComponentLink7Description: https://datasheet.ciiva.com/7746/1738695-7746281.pdf?src-supplier=Element14; ComponentLink8URL: https://datasheet.ciiva.com/8896/pyu-rc0603-51-rohs-l-4-8896106.pdf?src-supplier=Avnet; ComponentLink8Description: https://datasheet.ciiva.com/8896/pyu-rc0603-51-rohs-l-4-8896106.pdf?src-supplier=Avnet; ComponentLink9URL: https://datasheet.ciiva.com/15189/getdatasheetpartid-404327-15189644.pdf?src-supplier=Verical; ComponentLink9Description: https://datasheet.ciiva.com/15189/getdatasheetpartid-404327-15189644.pdf?src-supplier=Verical; ComponentLink10URL: https://datasheet.ciiva.com/7983/443971-7983613.pdf?src-supplier=Element14; ComponentLink10Description: https://datasheet.ciiva.com/7983/443971-7983613.pdf?src-supplier=Element14; Supplier Part Number 1: 311-1.00KHRCT-ND
R9 = RC0603FR-0712KL: YAGEO - RC0603FR-0712KL - SMD Chip Resistor, 0603 [1608 Metric], 12 kohm, RC Series, 75 V, Thick Film, 100 mW; Resistance: 12kR; Tolerance: 1%; Power Rating: 100mW; Voltage Rating (DC): 50V; Temperature Coefficient: 100ppm/°C; Supplier 1: Digi-Key; Manufacturer: Yageo; Manufacturer Part Number: RC0603FR-0712KL; RoHS: Yes; Category: Chip SMD Resistors; Stock 1: 408584; Pricing 1: 1=0.10000, 10=0.02100, 100=0.00850, 1000=0.00382, 2500=0.00331 (USD); Case/Package: 0603; Number of Pins: 2; Case Code (Imperial): 0603; Case Code (Metric): 1608; Min Operating Temperature: -55°C; Max Operating Temperature: 155°C; Packaging: Tape and Reel; Voltage Rating: 50V; Termination: SMD/SMT; Resistor Type: Thick Film; Package Quantity: 1; Number of Terminations: 2; Max Power Dissipation: 100mW; Features: Moisture Resistant; Length: 0.063inch; Width: 0.031inch; Height: 0.022inch; Depth: 0.8mm; REACH SVHC: No SVHC; Lead Free: Lead Free; Military Standard: Not; Supplier Part Number 1: 311-12.0KHRCT-ND
R10-R14 R16-R18 R21 = RC0603FR-074K7L: RES SMD 4.7K OHM 1% 1/10W 0603; Manufacturer: Yageo; Resistance: 4.7kR; Voltage Rating (DC): 50V; Temperature Coefficient: 100ppm/°C; Power Rating: 100mW; Supplier 1: Digi-Key; Manufacturer Part Number: RC0603FR-074K7L; RoHS: Yes; Category: Chip SMD Resistors; Stock 1: 6057521; Pricing 1: 1=0.100000, 10=0.021000, 100=0.008400, 1000=0.003790, 2500=0.003290 (USD); Case/Package: 0603; Number of Pins: 2; Case Code (Imperial): 0603; Case Code (Metric): 1608; Min Operating Temperature: -55°C; Max Operating Temperature: 155°C; Packaging: Tape and Reel; Tolerance: 1%; Resistor Type: Thick Film; Voltage Rating: 50V; Termination: SMD/SMT; Length: 1.6mm; Width: 0.8mm; Height: 0.45mm; Depth: 0.8mm; Lead Pitch: 0.3mm; REACH SVHC: No SVHC; Lead Free: Lead Free; Military Standard: Not; ComponentLink1URL: https://datasheet.ciiva.com/15189/getdatasheetpartid-422754-15189760.pdf?src-supplier=Verical; ComponentLink1Description: https://datasheet.ciiva.com/15189/getdatasheetpartid-422754-15189760.pdf?src-supplier=Verical; ComponentLink2URL: https://datasheet.ciiva.com/22747/443971-22747528.pdf?src-supplier=Element14; ComponentLink2Description: https://datasheet.ciiva.com/22747/443971-22747528.pdf?src-supplier=Element14; ComponentLink3URL: https://datasheet.ciiva.com/7660/38590-7660794.pdf?src-supplier=Element14; ComponentLink3Description: https://datasheet.ciiva.com/7660/38590-7660794.pdf?src-supplier=Element14; ComponentLink4URL: https://datasheet.ciiva.com/7746/1868787-7746365.pdf?src-supplier=Element14; ComponentLink4Description: https://datasheet.ciiva.com/7746/1868787-7746365.pdf?src-supplier=Element14; ComponentLink5URL: https://datasheet.ciiva.com/46440/1868787-46440909.pdf?src-supplier=Element14; ComponentLink5Description: https://datasheet.ciiva.com/46440/1868787-46440909.pdf?src-supplier=Element14; ComponentLink6URL: https://datasheet.ciiva.com/7746/1738695-7746366.pdf?src-supplier=Element14; ComponentLink6Description: https://datasheet.ciiva.com/7746/1738695-7746366.pdf?src-supplier=Element14; Supplier Part Number 1: 311-4.70KHRCT-ND
R19 R20 = RC0603FR-07220RL: THICK FILM RESISTOR, 220 OHM, 100mW, 1%; Product Range:RC Series; Resistance:220ohm; Power Rating:100mW; Resistance Tolerance: 1%; Voltage Rating:50V; Resistor Case Style:0603 [1608 Metric]; Packaging:Cut Tape; MSL:-; No. of Pins:2 ;RoHS Compliant: Yes; Manufacturer: Yageo; Voltage Rating (DC): 50V; Temperature Coefficient: 100ppm/°C; Supplier 1: Digi-Key; Manufacturer Part Number: RC0603FR-07220RL; RoHS: Yes; Category: Chip SMD Resistors; Stock 1: 3633930; Pricing 1: 1=0.10000, 10=0.02100, 100=0.00850, 1000=0.00382, 2500=0.00331 (USD); Case/Package: 0603; Number of Pins: 2; Case Code (Imperial): 0603; Case Code (Metric): 1608; Min Operating Temperature: -55°C; Max Operating Temperature: 155°C; Resistance: 220R; Tolerance: 1%; Packaging: Tape and Reel; Power Rating: 100mW; Resistor Type: Thick Film; Voltage Rating: 50V; Package Quantity: 1; Termination: SMD/SMT; Number of Terminations: 2; Max Power Dissipation: 100mW; Features: Moisture Resistant; Length: 1.6mm; Width: 0.031inch; Height: 0.022inch; Depth: 0.8mm; REACH SVHC: No SVHC; Lead Free: Lead Free; Military Standard: Not; ComponentLink1URL: https://datasheet.ciiva.com/2453/pyu-r-int-thick-7-2453973.pdf?src-supplier=Digi-Key; ComponentLink1Description: https://datasheet.ciiva.com/2453/pyu-r-int-thick-7-2453973.pdf?src-supplier=Digi-Key; ComponentLink2URL: https://datasheet.ciiva.com/2453/pyu-r-int-thick-7-2453974.pdf?src-supplier=Digi-Key; ComponentLink2Description: https://datasheet.ciiva.com/2453/pyu-r-int-thick-7-2453974.pdf?src-supplier=Digi-Key; ComponentLink3URL: https://datasheet.ciiva.com/2453/pyu-r-int-thick-7-2453975.pdf?src-supplier=Digi-Key; ComponentLink3Description: https://datasheet.ciiva.com/2453/pyu-r-int-thick-7-2453975.pdf?src-supplier=Digi-Key; ComponentLink4URL: https://datasheet.ciiva.com/7746/1738695-7746300.pdf?src-supplier=Element14; ComponentLink4Description: https://datasheet.ciiva.com/7746/1738695-7746300.pdf?src-supplier=Element14; ComponentLink5URL: https://datasheet.ciiva.com/7746/1738695-7746301.pdf?src-supplier=Element14; ComponentLink5Description: https://datasheet.ciiva.com/7746/1738695-7746301.pdf?src-supplier=Element14; Supplier Part Number 1: 311-220HRCT-ND
SW1-SW4 = 204-211ST: SWITCH SLIDE DIP DPST 50MA 24V; Manufacturer: CTS; Body Material: Plastic; Electrical Life: 5000Cycles; Actuator Type: Slide (Standard); Number of Positions: 1; Pitch: 0.1inch; Washable: Yes; Supplier 1: Digi-Key; Manufacturer Part Number: 204-211ST; RoHS: Yes; Category: DIP Switches; Stock 1: 484; Pricing 1: 1=1.12000, 10=1.07400, 25=1.00920, 100=0.87190, 250=0.79460, 500=0.73878, 1000=0.68723, 2500=0.62280, 5000=0.57985 (USD); Mount: Surface Mount; Contact Material: Copper Alloy; Contact Plating: Gold; Min Operating Temperature: -55°C; Max Operating Temperature: 85°C; Current Rating: 50mA; Orientation: Straight; Max Voltage Rating (DC): 24V; Max Current Rating: 50mA; Packaging: Rail/Tube; Throw Configuration: DPST; Package Quantity: 75; Voltage Rating (DC): 24V; Termination: Gull Wing; Length: 0.286inch; Terminal Pitch: 2.54mm; Depth: 10.4mm; Radiation Hardening: No; Lead Free: Lead Free; ComponentLink1URL: https://datasheet.ciiva.com/26926/getdatasheetpartid-769803-26926535.pdf?src-supplier=Verical; ComponentLink1Description: https://datasheet.ciiva.com/26926/getdatasheetpartid-769803-26926535.pdf?src-supplier=Verical; ComponentLink2URL: https://datasheet.ciiva.com/15184/getdatasheetpartid-79409-15184804.pdf?src-supplier=Verical; ComponentLink2Description: https://datasheet.ciiva.com/15184/getdatasheetpartid-79409-15184804.pdf?src-supplier=Verical; ComponentLink3URL: https://datasheet.ciiva.com/2863/204-2863571.pdf?src-supplier=Digi-Key; ComponentLink3Description: https://datasheet.ciiva.com/2863/204-2863571.pdf?src-supplier=Digi-Key; ComponentLink4URL: https://datasheet.ciiva.com/29881/204-29881849.pdf?src-supplier=Avnet; ComponentLink4Description: https://datasheet.ciiva.com/29881/204-29881849.pdf?src-supplier=Avnet; Supplier Part Number 1: CT204211ST-ND
U1 = FT2232H-56Q-TRAY: IC DUAL USB TO UART/FIFO 56VQFN; Manufacturer: FTDI; Interface: UART; Supplier 1: Digi-Key; Manufacturer Part Number: FT2232H-56Q-TRAY; RoHS: Yes; Category: Integrated Circuits (ICs); Stock 1: 3176; Pricing 1: 1=5.80000, 10=5.50000, 50=5.20000, 100=4.80000, 250=4.40000, 500=4.00002, 1000=3.95981 (USD); Case/Package: VQFN; Min Operating Temperature: -40°C; Max Operating Temperature: 85°C; Packaging: Tray; ComponentLink1URL: http://www.mouser.com/ds/2/163/DS_FT2232H-17353.pdf?src-supplier=Mouser; ComponentLink1Description: http://www.mouser.com/ds/2/163/DS_FT2232H-17353.pdf?src-supplier=Mouser; ComponentLink2URL: http://www.ftdichip.com/Support/Documents/DataSheets/ICs/DS_FT2232H.pdf?src-supplier=Digi-Key; ComponentLink2Description: http://www.ftdichip.com/Support/Documents/DataSheets/ICs/DS_FT2232H.pdf?src-supplier=Digi-Key; Supplier Part Number 1: 768-1276-ND
U2 = 93LC56BT-I/OT: MICROCHIP - 93LC56BT-I/OT. - 2K, 128 X 16, SERIAL EE, IND ROHS COMPLIANT: YES; Density: 2Kb; Max Supply Voltage: 5.5V; Min Supply Voltage: 2.5V; Access Time: 250ns; Frequency: 2MHz; Nominal Supply Current: 2mA; Memory Type: EEPROM; Supplier 1: Digi-Key; Manufacturer: Microchip; Manufacturer Part Number: 93LC56BT-I/OT; RoHS: Yes; Category: EEPROM; Stock 1: 6313; Pricing 1: 1=0.22000, 25=0.21000, 100=0.20000 (USD); Mount: Surface Mount; Case/Package: SOT-23; Number of Pins: 6; Contact Plating: Tin,Matte; Min Operating Temperature: -40°C; Max Operating Temperature: 85°C; Packaging: Tape and Reel; Package Quantity: 3000; Interface: Serial; Memory Size: 2Kb; Max Frequency: 2MHz; Length: 3.1mm; Width: 1.8mm; Height: 1.3mm; Radiation Hardening: No; REACH SVHC: No SVHC; Lead Free: Lead Free; ComponentLink1URL: https://datasheet.ciiva.com/48496/jp013939-48496476.pdf?src-supplier=Avnet; ComponentLink1Description: https://datasheet.ciiva.com/48496/jp013939-48496476.pdf?src-supplier=Avnet; ComponentLink2URL: https://datasheet.ciiva.com/16216/filehandler-aspxddocname-en013939-16216574.pdf?src-supplier=Future+Electronics; ComponentLink2Description: https://datasheet.ciiva.com/16216/filehandler-aspxddocname-en013939-16216574.pdf?src-supplier=Future+Electronics; ComponentLink3URL: https://datasheet.ciiva.com/3185/jp013939-3185519.pdf?src-supplier=Avnet; ComponentLink3Description: https://datasheet.ciiva.com/3185/jp013939-3185519.pdf?src-supplier=Avnet; ComponentLink4URL: https://datasheet.ciiva.com/16622/jp013939-16622127.pdf?src-supplier=Avnet+Europe; ComponentLink4Description: https://datasheet.ciiva.com/16622/jp013939-16622127.pdf?src-supplier=Avnet+Europe; Supplier Part Number 1: 93LC56BT-I/OTCT-ND
X1 = 8Z-12.000MAAJ-T: Crystal 12MHz ±30ppm (Tol) ±30ppm (Stability) 18pF FUND 150Ohm 4-Pin SMD T/R; Manufacturer: TXC; ESR (Equivalent Series Resistance): 150R; Supplier 1: Digi-Key; Manufacturer Part Number: 8Z-12.000MAAJ-T; RoHS: Yes; Category: Crystals; Stock 1: 6521; Pricing 1: 1=1.35000, 10=1.29000, 50=1.26000, 100=1.08000, 500=1.05000, 1000=0.88500 (USD); Mount: Surface Mount; Case/Package: SMD/SMT; Number of Pins: 4; Min Operating Temperature: -20°C; Max Operating Temperature: 70°C; Frequency Stability: 30ppm; Termination: SMD/SMT; Package Quantity: 1; Frequency: 12MHz; Frequency Tolerance: 30ppm; Load Capacitance: 18pF; Packaging: Tape and Reel; Tolerance: 30ppm; Length: 2.5mm; Width: 0.079inch; Height: 0.022inch; Depth: 2mm; REACH SVHC: No SVHC; ComponentLink1URL: https://datasheet.ciiva.com/28498/1838674-28498900.pdf?src-supplier=Element14; ComponentLink1Description: https://datasheet.ciiva.com/28498/1838674-28498900.pdf?src-supplier=Element14; ComponentLink2URL: https://datasheet.ciiva.com/4950/8z-12784-4950167.pdf?src-supplier=Mouser; ComponentLink2Description: https://datasheet.ciiva.com/4950/8z-12784-4950167.pdf?src-supplier=Mouser; ComponentLink3URL: https://datasheet.ciiva.com/859/8z-859072.pdf?src-supplier=Digi-Key; ComponentLink3Description: https://datasheet.ciiva.com/859/8z-859072.pdf?src-supplier=Digi-Key; ComponentLink4URL: https://datasheet.ciiva.com/859/8z-859073.pdf?src-supplier=Digi-Key; ComponentLink4Description: https://datasheet.ciiva.com/859/8z-859073.pdf?src-supplier=Digi-Key; ComponentLink5URL: https://datasheet.ciiva.com/859/8z-859071.pdf?src-supplier=Digi-Key; ComponentLink5Description: https://datasheet.ciiva.com/859/8z-859071.pdf?src-supplier=Digi-Key; ComponentLink6URL: https://datasheet.ciiva.com/8047/1041872-8047871.pdf?src-supplier=Element14; ComponentLink6Description: https://datasheet.ciiva.com/8047/1041872-8047871.pdf?src-supplier=Element14; Supplier Part Number 1: 887-1487-1-ND